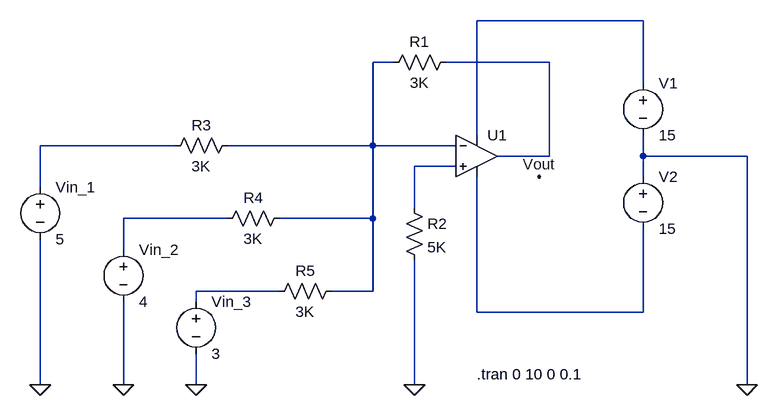
[diagram p0: schematic Exp 8 (Summing).asc]
Exp 8 (Summing).asc, the LTspice schematic file:
Version 4
SHEET 1 880 680
WIRE 352 -48 96 -48
WIRE -32 16 -64 16
WIRE 208 16 48 16
WIRE 352 48 352 -48
WIRE 96 128 96 -48
WIRE -368 144 -576 144
WIRE -64 144 -64 16
WIRE -64 144 -288 144
WIRE 64 144 -64 144
WIRE 208 160 208 16
WIRE 208 160 128 160
WIRE 352 160 352 128
WIRE 512 160 352 160
WIRE 64 176 0 176
WIRE 352 192 352 160
WIRE -576 208 -576 144
WIRE 0 240 0 176
WIRE -288 256 -448 256
WIRE -64 256 -64 144
WIRE -64 256 -208 256
WIRE -448 304 -448 256
WIRE -208 368 -336 368
WIRE -64 368 -64 256
WIRE -64 368 -128 368
WIRE -336 384 -336 368
WIRE 96 400 96 192
WIRE 352 400 352 272
WIRE 352 400 96 400
WIRE -576 512 -576 288
WIRE -448 512 -448 384
WIRE -336 512 -336 464
WIRE 0 512 0 320
WIRE 512 512 512 160
FLAG 0 512 0
FLAG -336 512 0
FLAG -576 512 0
FLAG -448 512 0
FLAG 512 512 0
FLAG 192 192 Vout
SYMBOL OpAmps\\UniversalOpamp2 96 160 R0
SYMATTR InstName U1
SYMBOL voltage 352 32 R0
WINDOW 123 0 0 Left 0
WINDOW 39 0 0 Left 0
SYMATTR InstName V1
SYMATTR Value 15
SYMBOL voltage 352 176 R0
WINDOW 123 0 0 Left 0
WINDOW 39 0 0 Left 0
SYMATTR InstName V2
SYMATTR Value 15
SYMBOL res 64 0 R90
WINDOW 0 0 56 VBottom 2
WINDOW 3 32 56 VTop 2
SYMATTR InstName R1
SYMATTR Value 3K
SYMBOL res -16 224 R0
SYMATTR InstName R2
SYMATTR Value 5K
SYMBOL res -272 128 R90
WINDOW 0 0 56 VBottom 2
WINDOW 3 32 56 VTop 2
SYMATTR InstName R3
SYMATTR Value 3K
SYMBOL res -192 240 R90
WINDOW 0 0 56 VBottom 2
WINDOW 3 32 56 VTop 2
SYMATTR InstName R4
SYMATTR Value 3K
SYMBOL res -112 352 R90
WINDOW 0 0 56 VBottom 2
WINDOW 3 32 56 VTop 2
SYMATTR InstName R5
SYMATTR Value 3K
SYMBOL voltage -576 192 R0
WINDOW 123 0 0 Left 0
WINDOW 39 0 0 Left 0
SYMATTR InstName Vin_1
SYMATTR Value 5
SYMBOL voltage -448 288 R0
WINDOW 123 0 0 Left 0
WINDOW 39 0 0 Left 0
SYMATTR InstName Vin_2
SYMATTR Value 4
SYMBOL voltage -336 368 R0
WINDOW 123 0 0 Left 0
WINDOW 39 0 0 Left 0
SYMATTR InstName Vin_3
SYMATTR Value 3
TEXT 96 496 Left 2 !.tran 0 10 0 0.1

The netlist it stands for:
* Exp 8 (Summing).asc
XU1 N005 N002 N001 N008 N003 level.2 Avol=1Meg GBW=10Meg Slew=10Meg ilimit=25m rail=0 Vos=0 phimargin=45 en=0 enk=0 in=0 ink=0 Rin=500Meg  ; pins IN+ IN- V+ V- OUT
V1 N001 0 15
V2 0 N008 15
R1 N003 N002 3K
R2 N005 0 5K
R3 N002 N004 3K
R4 N002 N006 3K
R5 N002 N007 3K
Vin_1 N004 0 5
Vin_2 N006 0 4
Vin_3 N007 0 3
.tran 0 10 0 0.1
.lib UniversalOpamps2.sub
.backanno
.end